# EAGLE design LCDPlug (EAGLE 7.2.0)
ABBREV: lp1; PROJECT: LCD Plug
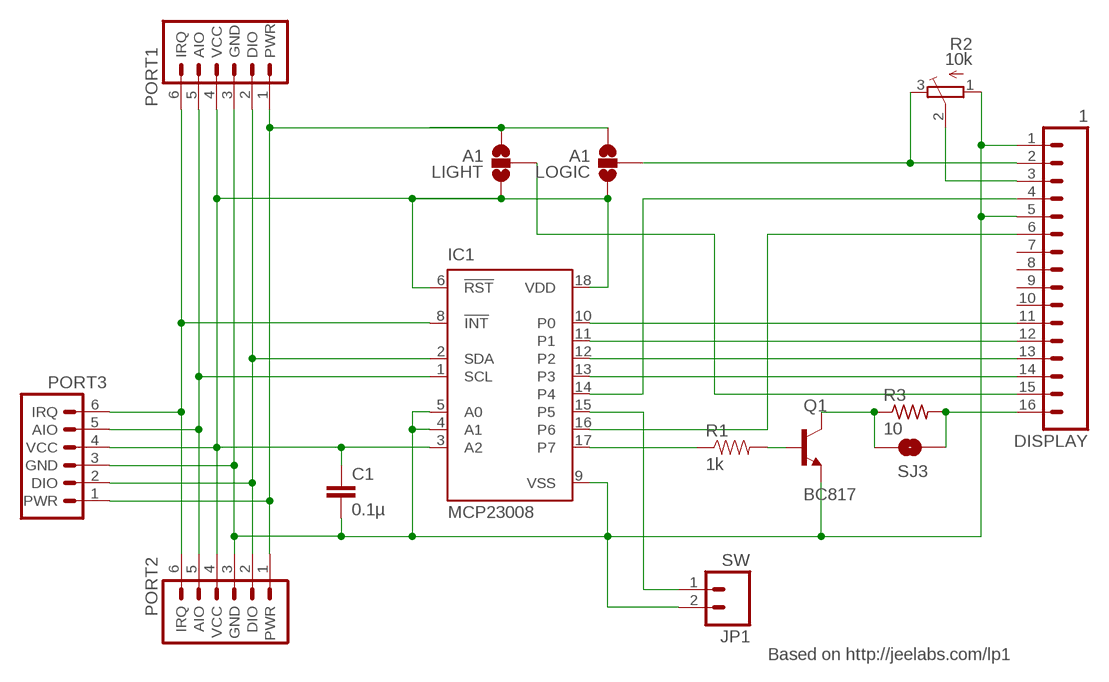
[diagram p0: schematic, sheet 1]

## Parts
C1  0.1µ  CAP0603-CAP  [0603-CAP]
DISPLAY  1  M16PTH  [1X16]
IC1  MCP23008  MCP23008T  [SO18W]
JP1  SW  M02PTH  [1X02]
LIGHT  A1  SOLDERJUMPER_2WAYT  [SJ_2]
LOGIC  A1  SOLDERJUMPER_2WAYT  [SJ_2]
PORT1  JEEPORT  JEEPORT-LONGPADS  [PORT6PIN]
PORT2  JEEPORT  JEEPORT-LONGPADS  [PORT6PIN]
PORT3  JEEPORT  JEEPORT-LONGPADS  [PORT6PIN]
Q1  BC817  TRANSISTOR_NPNSOT23-3  [SOT23-3]
R1  1k  RESISTOR0603-RES  [0603-RES]
R2  10k  TRIM_EU-SM-42/43W  [SM-42/43W]
R3  10  R-US_0204/7  [0204/7]
SJ3  SOLDERJUMPERNO  [SJ_2S-NO]

## Nets
GND [power]: C1.2 DISPLAY.1 DISPLAY.5 IC1.4(A1) IC1.5(A0) IC1.9(VSS) JP1.2 PORT1.3(GND) PORT2.3(GND) PORT3.3(GND) Q1.2(E) R2.1(A)
N$1: IC1.8(!INT) PORT1.6(IRQ) PORT2.6(IRQ) PORT3.6(IRQ)
N$2: IC1.1(SCL) PORT1.5(AIO) PORT2.5(AIO) PORT3.5(AIO)
N$3: DISPLAY.11 IC1.10(P0)
N$4: DISPLAY.12 IC1.11(P1)
N$5: IC1.2(SDA) PORT1.2(DIO) PORT2.2(DIO) PORT3.2(DIO)
N$6: DISPLAY.13 IC1.12(P2)
N$7: DISPLAY.14 IC1.13(P3)
N$8 [power]: DISPLAY.15 LIGHT.2
N$9 [power]: Q1.3(C) R3.1 SJ3.2
N$10: IC1.17(P7) R1.1
N$11: Q1.1(B) R1.2
N$12: DISPLAY.6 IC1.16(P6)
N$13: IC1.15(P5) JP1.1
N$14: DISPLAY.4 IC1.14(P4)
N$15 [power]: DISPLAY.2 LOGIC.2 R2.3(E)
N$16 [power]: DISPLAY.16 R3.2 SJ3.1
N$20: DISPLAY.3 R2.2(S)
PWR [power]: LIGHT.3 LOGIC.3 PORT1.1(PWR) PORT2.1(PWR) PORT3.1(PWR)
VCC [power]: C1.1 IC1.3(A2) IC1.6(!RST) IC1.18(VDD) LIGHT.1 LOGIC.1 PORT1.4(VCC) PORT2.4(VCC) PORT3.4(VCC)
Unconnected: DISPLAY.7 DISPLAY.8 DISPLAY.9 DISPLAY.10

## Notes on the sheet
- Based on http://jeelabs.com/lp1

## Library data of the parts
C1 = SparkFun:CAP: Capacitor Standard 0603 ceramic capacitor, and 0.1" leaded capacitor.
DISPLAY = SparkFun:M16
IC1 = JeeLabs:MCP23008: I2C-Bus Remote 8-bit I/O expander http://www.semiconductors.philips.com/acrobat_download/datasheets/PCF8574_4.pdf
JP1 = SparkFun:M02: Header 2 Standard 2-pin 0.1" header. Use with straight break away headers (SKU : PRT-00116), right angle break away headers (PRT-00553), swiss pins (PRT-00743), machine pins (PRT-00117), and female headers (PRT-00115). Molex polarized connector foot print use with SKU : PRT-08233 with associated crimp pins and housings.
LIGHT LOGIC = SparkFun:SOLDERJUMPER_2WAY: Solder Jumper 2 way solder jumper
PORT1-PORT3 = JeeLabs:JEEPORT: PIN HEADER
Q1 = SparkFun:TRANSISTOR_NPN: Transistor NPN BJT configuration in SOT23 package. MMBT2222 is the common NPN we use. Double check BCE configuration again layout.
R1 = SparkFun:RESISTOR: Resistor Basic schematic elements and footprints for 0603, 1206, and PTH 1/10th watt (small) resistors.
R2 = pot:TRIM_EU-: POTENTIOMETER
R3 = resistor:R-US_: RESISTOR, American symbol
SJ3 = SparkFun:SOLDERJUMPER: Solder Jumper Standard SMD solder jumper. Used to automate production. Two varients : Normally Open and Normally Closed are the same, but have different paste layers. NC will have a large amount of paste and should jumper during reflow.

## Net classes
0 default: width 0.203 mm
1 power: width 0.381 mm

## Board
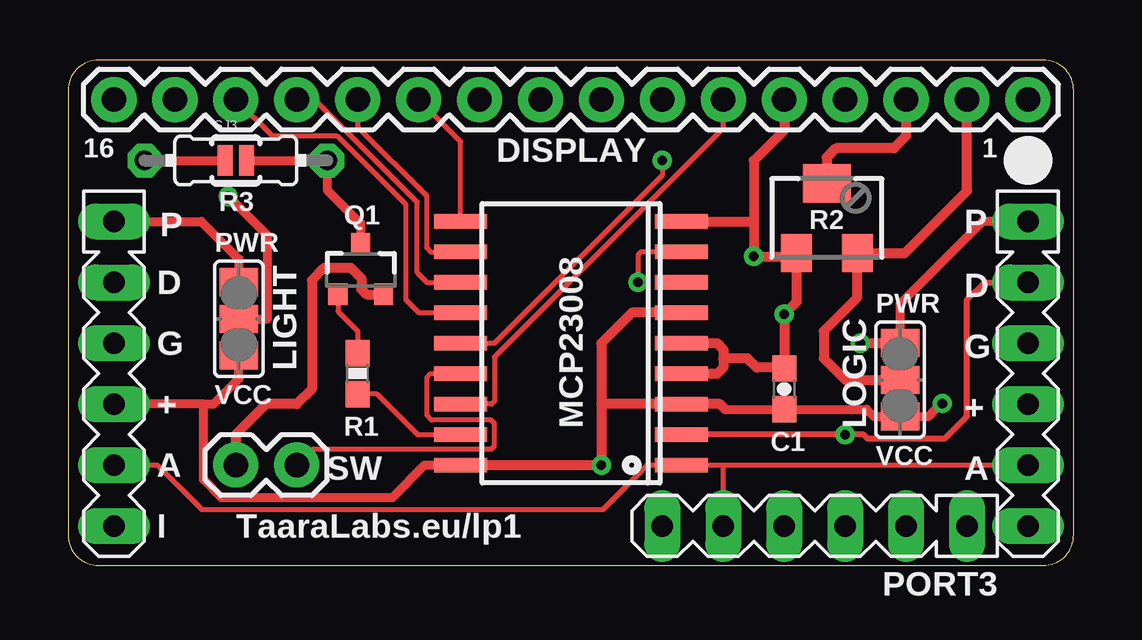
[diagram p1: board, top side]
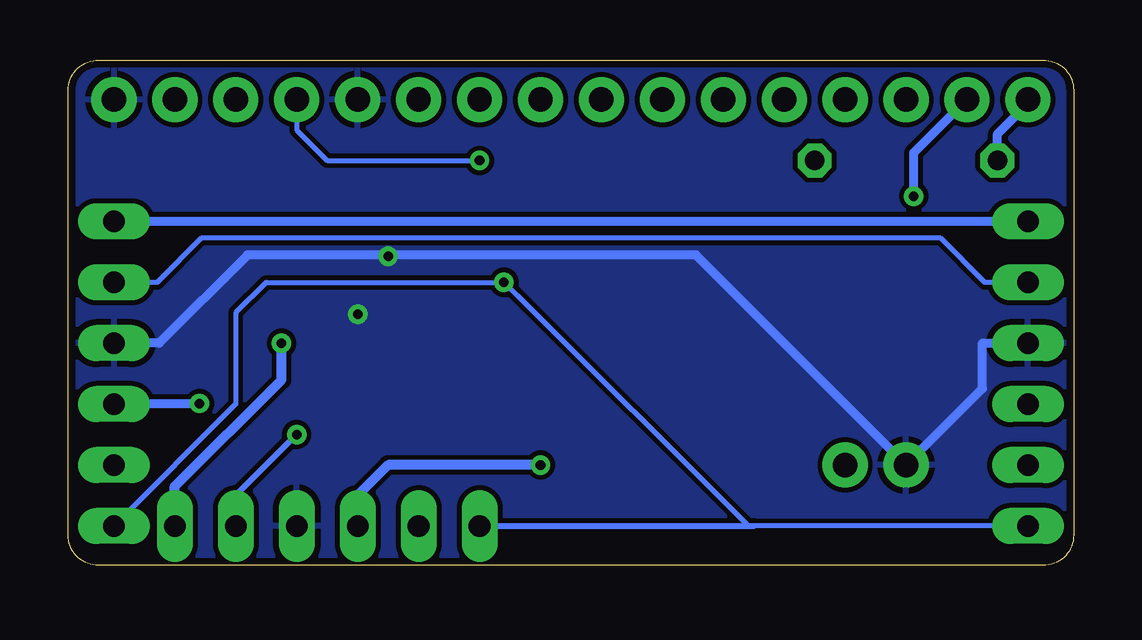
[diagram p2: board, bottom side, seen from below]

Size 41.91 x 21.08 mm. Coordinates in mm from the lower left corner, seen from the top.
Outline: 0,19.81 0,1.27 arc90 1.27,0 40.64,0 arc90 41.91,1.27 41.91,19.81 arc90 40.64,21.08 1.27,21.08 arc90 0,19.81
Copper layers (1*16): Top 0.035mm / dielectric 1.5mm / Bottom 0.035mm
Design rules "default *": minimum track width 8mil, minimum drill 0.4mm, track to track 8mil, track to pad 8mil, pad to pad 8mil, via to via 8mil, smd to smd 8mil, copper to edge 12mil, drill to drill 8mil, minimum pad ring 0.3mm, minimum via ring 8mil, stop-mask expansion 4mil, vias tented up to drill 25mil, thermal gap 10mil

### Footprints (pad centres in the part's own frame; a part is rotated, then mirrored left to right if it is on the bottom)
0603-CAP = smd 1.1 x 1: 1 -0.85,0; 2 0.85,0
1X16 = drill 1.016 pad 1.88: 1 0,0; 2 2.54,0; 3 5.08,0; 4 7.62,0; 5 10.16,0; 6 12.7,0; 7 15.24,0; 8 17.78,0; 9 20.32,0; 10 22.86,0; 11 25.4,0; 12 27.94,0; 13 30.48,0; 14 33.02,0; 15 35.56,0; 16 38.1,0
SO18W = smd 0.6 x 2.2: 1 -5.08,-4.6; 2 -3.81,-4.6; 3 -2.54,-4.6; 4 -1.27,-4.6; 5 0,-4.6; 6 1.27,-4.6; 7 2.54,-4.6; 8 3.81,-4.6; 9 5.08,-4.6; 10 5.08,4.6; 11 3.81,4.6; 12 2.54,4.6; 13 1.27,4.6; 14 0,4.6; 15 -1.27,4.6; 16 -2.54,4.6; 17 -3.81,4.6; 18 -5.08,4.6
1X02 = drill 1.016 pad 1.88: 1 0,0; 2 2.54,0
SJ_2 = smd 1.168 x 1.6: 1 -1.524,0; 2 0,0; 3 1.524,0
PORT6PIN = drill 0.9 long: 1 -6.35,0; 2 -3.81,0; 3 -1.27,0; 4 1.27,0; 5 3.81,0; 6 6.35,0
SOT23-3 = smd 0.8 x 0.9: 1 -0.95,-1; 2 0.95,-1; 3 0,1.1
0603-RES = smd 1.1 x 1: 1 -0.85,0; 2 0.85,0
SM-42/43W = smd 1.3 x 1.6: 1 -1.27,-1.45; 3 1.27,-1.45 | smd 2 x 1.6: 2 0,1.45
0204/7 = drill 0.813 octagon: 1 -3.81,0; 2 3.81,0
SJ_2S-NO = smd 0.635 x 1.27: 1 -0.45,0; 2 0.45,0

### Placement (x,y rotation side)
C1  29.84,7.37 90 top
DISPLAY  40.01,19.43 180 top
IC1  20.95,9.27 90 top
JP1  9.53,4.19 180 top
LIGHT  7.11,10.29 90 top
LOGIC  34.67,7.75 90 top
PORT1  1.91,8 270 top
PORT2  40.01,8 270 top
PORT3  31.11,1.65 180 top
Q1  12.19,12.32 0 top
R1  12.06,8 90 top
R2  31.62,14.48 0 top
R3  6.99,16.89 180 top
SJ3  6.99,16.89 0 top

### Tracks (layer width: path | path; a pad name or v marks a point on that pad's centre or on a via)
GND  (via drill 0.4 pad 0.81)
  Top 0.406: JP1.2 6.99,5.46 8.26,6.73 9.53,6.73 10.16,7.37 10.16,11.9 10.67,12.42 11.77,12.42 12.22,11.97 12.22,11.53 12.45,11.3 13.13,11.3 Q1.2 | IC1.4 27.05,8 27.3,8.26 27.3,8.64 | DISPLAY.5 29.84,18.16 28.57,16.89 28.57,14.35 | IC1.9 28.57,14.35 | IC1.5 27.05,9.27 27.3,9.02 27.3,8.64 | 27.3,8.64 28.32,8.64 28.7,8.26 29.81,8.26 C1.2 v29.84,10.48 30.35,10.99 R2.1 | 30.3,13.08 R2.1 | 28.57,14.35 v28.57,12.89 30.22,12.89 arc90 R2.1 | 30.28,12.95 R2.1
  Bottom 0.381: PORT2.3 38.11,9.27 34.43,12.95 15.74,12.95 JP1.2 3.8,7.38 3.8,9.27 PORT1.3
  pour Bottom: 40.64,0 1.27,0 arc-90 0,1.27 0,19.81 arc-90 1.27,21.08 40.64,21.08 arc-90 41.91,19.81 41.91,1.27 arc-90
N$1  (via drill 0.4)
  Top 0.203: IC1.8 23.88,13.08 23.75,12.95 v23.75,11.81
  Bottom 0.203: PORT1.6 13.34,1.65 | 13.56,1.65 23.15,11.25 v23.75,11.81 33.66,11.81 34.93,10.54 34.93,6.73 PORT2.6
  Bottom 0.254: PORT3.6 13.56,1.65 13.34,1.65
N$2
  Top 0.203: PORT1.5 3.71,4.19 5.56,2.34 22.3,2.34 24.15,4.19 IC1.1 27.3,4.19 | 27.3,4.19 PORT2.5 | PORT3.5 27.3,4.19
N$3
  Top 0.203: IC1.10 16.35,17.68 DISPLAY.11
N$4
  Top 0.203: DISPLAY.12 12.06,18.29 14.95,15.4 14.95,13.24 15.11,13.08 IC1.11
N$5  (via drill 0.4)
  Top 0.254: IC1.2 v32.39,5.46 33.15,5.46 33.31,5.29 36.54,5.29 37.47,6.22 37.47,11.08 38.2,11.81 PORT2.2
  Bottom 0.203: PORT1.2 3.71,11.81 5.54,13.65 36.37,13.65 38.2,11.81 PORT2.2
  Bottom 0.254: PORT3.2 34.93,2.92 v32.39,5.46
N$6
  Top 0.203: DISPLAY.13 10.27,19.43 14.54,15.16 14.54,12.22 14.95,11.81 IC1.12
N$7
  Top 0.203: DISPLAY.14 8.51,17.9 11.23,17.9 14.07,15.06 14.07,11.07 14.61,10.54 IC1.13
N$8  (via drill 0.4 pad 0.81)
  Top 0.381: LIGHT.2 8.31,10.29 8.31,13.76 v6.67,15.4
  Bottom 0.381: v6.67,15.4 6.67,17.21 DISPLAY.15
N$9
  Top 0.381: SJ3.2 R3.1 10.79,15.66 12.19,14.26 Q1.3
N$10
  Top 0.203: R1.1 12.87,7.15 14.56,5.46 IC1.17
N$11
  Top 0.203: Q1.1 11.24,10.6 12.06,9.78 R1.2
N$12
  Top 0.203: DISPLAY.6 27.3,18.24 17.76,8.7 17.76,6.84 17.65,6.73 IC1.16
N$13
  Top 0.203: JP1.1 10.19,4.86 17.63,4.86 17.76,4.98 17.76,5.93 17.62,6.07 15.15,6.07 14.95,6.27 14.95,7.84 15.11,8 IC1.15
N$14  (via drill 0.4)
  Top 0.203: IC1.14 17.76,9.27 24.76,16.28 v24.76,16.89
  Bottom 0.203: DISPLAY.4 32.39,18.16 31.11,16.89 v24.76,16.89
N$15
  Top 0.381: 33.07,13.03 R2.3
  Top 0.406: 33.07,13.03 34.87,13.03 37.47,15.62 DISPLAY.2 | R2.3 32.89,11.18 31.5,9.78 31.5,8.64 32.39,7.75 LOGIC.2
N$16
  Top 0.381: R3.2 SJ3.1
  Bottom 0.381: R3.2 3.17,17.99 1.91,19.26 DISPLAY.16
N$20
  Top 0.406: DISPLAY.3 34.93,17.91 34.42,17.4 32,17.4 31.62,17.02 R2.2
PWR  (via drill 0.4)
  Top 0.381: LIGHT.3 7.11,12.79 5.55,14.35 PORT1.1 | LOGIC.3 34.67,10.91 38.11,14.35 PORT2.1
  Top 0.406: v33.02,9.27 LOGIC.3
  Bottom 0.381: PORT1.1 PORT2.1
  Bottom 0.406: PORT3.1 37.47,3.3 33.02,7.75 v33.02,9.27
VCC  (via drill 0.4, 0.4 pad 0.81)
  Top 0.381: 5.63,6.73 6.06,6.73 7.11,7.78 LIGHT.1 | 5.63,6.73 PORT1.4 | 5.63,6.73 5.63,3.58 6.38,2.84 13.51,2.84 14.86,4.19 IC1.18 | IC1.3 27.18,6.73 | 27.39,6.52 C1.1 33.28,6.52 33.57,6.22 LOGIC.1 35.87,6.22 36.14,6.5 v36.44,6.76
  Top 0.406: IC1.18 v22.22,4.19 22.22,6.73 | IC1.6 23.49,10.54 22.22,9.27 22.22,6.73 | 27.39,6.52 27.18,6.73 22.22,6.73
  Bottom 0.381: PORT2.4 36.41,6.73 v36.44,6.76
  Bottom 0.406: v22.22,4.19 28.57,4.19 29.84,2.92 PORT3.4

### Text on the board
tPlace: P | P | D | D | G | G | + | + | A | A | I
_tsilk: 16 | PWR | PWR | VCC | C1 | VCC | TaaraLabs.eu/lp1